# EAGLE design main 1.0 (EAGLE 7.2.0)
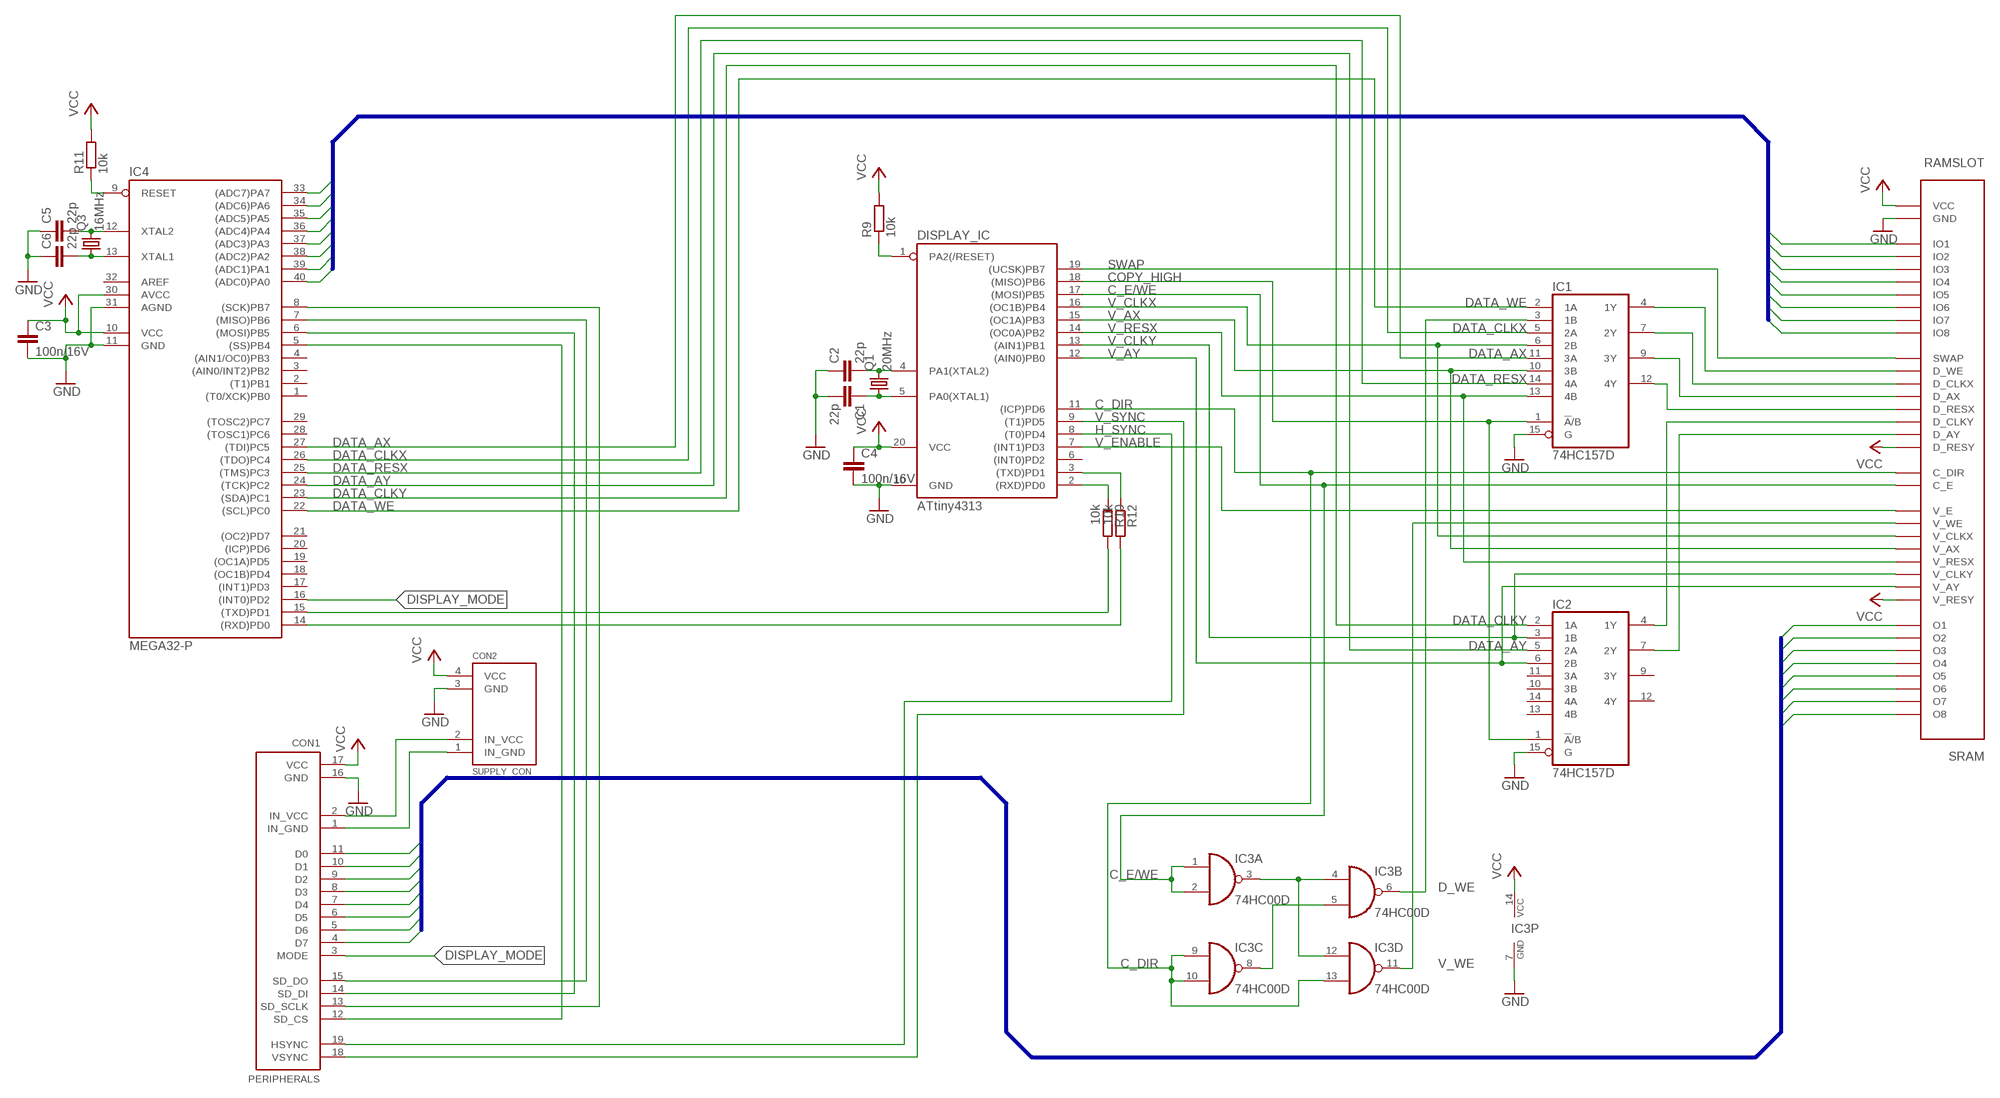
[diagram p0: schematic, sheet 1]

## Parts
C1  22p  C-EUC0603  [C0603]
C2  22p  C-EUC0603  [C0603]
C3  100n/16V  C-EUC0603  [C0603]
C4  100n/16V  C-EUC0603  [C0603]
C5  22p  C-EUC0603  [C0603]
C6  22p  C-EUC0603  [C0603]
CON1  PERIPHERALS  [PERIPHERALS_CON]
CON2  SUPPLY_CON  [SUPPLY_CON]
DISPLAY_IC  ATtiny4313  TINY2313-*P*  [DIL20]
IC1  74HC157D  [SO16]
IC2  74HC157D  [SO16]
IC3  74HC00D  [SO14]
IC4  MEGA32-P  [DIL40]
Q1  20MHz  CRYSTALS-NOGND-HC49  [HC49]
Q3  16MHz  CRYSTALS-NOGND-HC49  [HC49]
R9  10k  R-EU_R0603  [R0603]
R10  10k  R-EU_R0603  [R0603]
R11  10k  R-EU_R0603  [R0603]
R12  10k  R-EU_R0603  [R0603]
RAMSLOT  SRAM  SLOT  [SLOT]

## Nets
C_DIR: DISPLAY_IC.11((ICP)PD6) IC3.9(C:I0) IC3.10(C:I1) IC3.13(D:I1) RAMSLOT.C_DIR RAMSLOT.C_DIRB(C_DIR)
C_E/WE: DISPLAY_IC.17((MOSI)PB5) IC3.1(A:I0) IC3.2(A:I1) RAMSLOT.C_E RAMSLOT.C_EB(C_E)
COPY_HIGH: DISPLAY_IC.18((MISO)PB6) IC1.1(!A!/B) IC2.1(!A!/B)
D_WE: IC1.3(1B) IC3.6(B:O)
DATA0: IC4.40((ADC0)PA0) RAMSLOT.IO1 RAMSLOT.IO1B(IO1)
DATA1: IC4.39((ADC1)PA1) RAMSLOT.IO2 RAMSLOT.IO2B(IO2)
DATA2: IC4.38((ADC2)PA2) RAMSLOT.IO3 RAMSLOT.IO3B(IO3)
DATA3: IC4.37((ADC3)PA3) RAMSLOT.IO4 RAMSLOT.IO4B(IO4)
DATA4: IC4.36((ADC4)PA4) RAMSLOT.IO5 RAMSLOT.IO5B(IO5)
DATA5: IC4.35((ADC5)PA5) RAMSLOT.IO6 RAMSLOT.IO6B(IO6)
DATA6: IC4.34((ADC6)PA6) RAMSLOT.IO7 RAMSLOT.IO7B(IO7)
DATA7: IC4.33((ADC7)PA7) RAMSLOT.IO8 RAMSLOT.IO8B(IO8)
DATA_AX: IC1.11(3A) IC4.27((TDI)PC5)
DATA_AY: IC2.5(2A) IC4.24((TCK)PC2)
DATA_CLKX: IC1.5(2A) IC4.26((TDO)PC4)
DATA_CLKY: IC2.2(1A) IC4.23((SDA)PC1)
DATA_RESX: IC1.14(4A) IC4.25((TMS)PC3)
DATA_WE: IC1.2(1A) IC4.22((SCL)PC0)
DISPLAY_MODE: CON1.3(MODE) IC4.16((INT0)PD2)
GND: C1.2 C2.1 C3.2 C4.2 C5.1 C6.1 CON1.16(GND) CON2.3(GND) DISPLAY_IC.10(GND) IC1.15(G) IC2.15(G) IC3.7(P:GND) IC4.11(GND) IC4.31(AGND) RAMSLOT.GND RAMSLOT.GNDB(GND)
H_SYNC: CON1.19(HSYNC) DISPLAY_IC.8((T0)PD4)
IN_GND: CON1.1(IN_GND) CON2.1(IN_GND)
MAIN_RX: IC4.14((RXD)PD0) R12.2
MAIN_TX: IC4.15((TXD)PD1) R10.2
N$1: IC4.9(RESET) R11.1
N$3: IC3.3(A:O) IC3.4(B:I0) IC3.12(D:I0)
N$4: IC3.5(B:I1) IC3.8(C:O)
N$7: CON1.2(IN_VCC) CON2.2(IN_VCC)
N$12: DISPLAY_IC.1(PA2(/RESET)) R9.1
N$15: DISPLAY_IC.3((TXD)PD1) R12.1
N$16: C5.2 IC4.12(XTAL2) Q3.2
N$17: C6.2 IC4.13(XTAL1) Q3.1
N$24: DISPLAY_IC.2((RXD)PD0) R10.1
N$30: C1.1 DISPLAY_IC.5(PA0(XTAL1)) Q1.1
N$31: C2.2 DISPLAY_IC.4(PA1(XTAL2)) Q1.2
N$47: IC1.4(1Y) RAMSLOT.D_WE RAMSLOT.D_WEB(D_WE)
N$48: IC1.7(2Y) RAMSLOT.D_CLKX RAMSLOT.D_CLKXB(D_CLKX)
N$49: IC1.9(3Y) RAMSLOT.D_AX RAMSLOT.D_AXB(D_AX)
N$50: IC1.12(4Y) RAMSLOT.D_RESX RAMSLOT.D_RESXB(D_RESX)
N$51: IC2.4(1Y) RAMSLOT.D_CLKY RAMSLOT.D_CLKYB(D_CLKY)
N$52: IC2.7(2Y) RAMSLOT.D_AY RAMSLOT.D_AYB(D_AY)
O0: CON1.11(D0) RAMSLOT.O1 RAMSLOT.O1B(O1)
O1: CON1.10(D1) RAMSLOT.O2 RAMSLOT.O2B(O2)
O2: CON1.9(D2) RAMSLOT.O3 RAMSLOT.O3B(O3)
O3: CON1.8(D3) RAMSLOT.O4 RAMSLOT.O4B(O4)
O4: CON1.7(D4) RAMSLOT.O5 RAMSLOT.O5B(O5)
O5: CON1.6(D5) RAMSLOT.O6 RAMSLOT.O6B(O6)
O6: CON1.5(D6) RAMSLOT.O7 RAMSLOT.O7B(O7)
O7: CON1.4(D7) RAMSLOT.O8 RAMSLOT.O8B(O8)
SD_CS: CON1.12(SD_CS) IC4.5((SS)PB4)
SD_DI: CON1.14(SD_DI) IC4.6((MOSI)PB5)
SD_DO: CON1.15(SD_DO) IC4.7((MISO)PB6)
SD_SCLK: CON1.13(SD_SCLK) IC4.8((SCK)PB7)
SWAP: DISPLAY_IC.19((UCSK)PB7) RAMSLOT.SWAP RAMSLOT.SWAPB(SWAP)
V_AX: DISPLAY_IC.15((OC1A)PB3) IC1.10(3B) RAMSLOT.V_AX RAMSLOT.V_AXB(V_AX)
V_AY: DISPLAY_IC.12((AIN0)PB0) IC2.6(2B) RAMSLOT.V_AY RAMSLOT.V_AYB(V_AY)
V_CLKX: DISPLAY_IC.16((OC1B)PB4) IC1.6(2B) RAMSLOT.V_CLKX RAMSLOT.V_CLKXB(V_CLKX)
V_CLKY: DISPLAY_IC.13((AIN1)PB1) IC2.3(1B) RAMSLOT.V_CLKY RAMSLOT.V_CLKYB(V_CLKY)
V_ENABLE: DISPLAY_IC.7((INT1)PD3) RAMSLOT.V_E RAMSLOT.V_EB(V_E)
V_RESX: DISPLAY_IC.14((OC0A)PB2) IC1.13(4B) RAMSLOT.V_RESX RAMSLOT.V_RESXB(V_RESX)
V_SYNC: CON1.18(VSYNC) DISPLAY_IC.9((T1)PD5)
V_WE: IC3.11(D:O) RAMSLOT.V_WE RAMSLOT.V_WEB(V_WE)
VCC: C3.1 C4.1 CON1.17(VCC) CON2.4(VCC) DISPLAY_IC.20(VCC) IC3.14(P:VCC) IC4.10(VCC) IC4.30(AVCC) R9.2 R11.2 RAMSLOT.D_RESY RAMSLOT.D_RESYB(D_RESY) RAMSLOT.V_RESY RAMSLOT.V_RESYB(V_RESY) RAMSLOT.VCC RAMSLOT.VCCB(VCC)
Unconnected: DISPLAY_IC.6((INT0)PD2) IC2.9(3Y) IC2.10(3B) IC2.11(3A) IC2.12(4Y) IC2.13(4B) IC2.14(4A) IC4.1((T0/XCK)PB0) IC4.2((T1)PB1) IC4.3((AIN0/INT2)PB2) IC4.4((AIN1/OC0)PB3) IC4.17((INT1)PD3) IC4.18((OC1B)PD4) IC4.19((OC1A)PD5) IC4.20((ICP)PD6) IC4.21((OC2)PD7) IC4.28((TOSC1)PC6) IC4.29((TOSC2)PC7)

## Buses
DATA[0..7]
O[0..7]

## Power pins joined to a net without a drawn wire
AREF: IC4.32(AREF)
GND: IC1.8(GND) IC2.8(GND)
VCC: IC1.16(VCC) IC2.16(VCC)

## Library data of the parts
C1-C6 = rcl:C-EU: CAPACITOR, European symbol
CON1 = peripherals connector:PERIPHERALS
CON2 = supply connector:SUPPLY_CON
DISPLAY_IC = avr-7:TINY2313*: Atmel Tiny2313 2K Flash, 128 bytes EEPROM, 128 bytes RAM
IC1 IC2 = 74xx-eu:74*157: Quadruple 2-line to 1-line data SELECTOR/MULTIPLEXER
IC3 = 74xx-eu:74*00: Quad 2-input NAND gate
IC4 = avr-7:MEGA32-P: MICROCONTROLLER 32 Kbytes FLASH 2 Kbytes SRAM 1 Kbytes EEPROM USART 8-channel 10 bit ADC
Q1 Q3 = IQD-Frequency-Products:CRYSTALS-NOGND: CRYSTALS CAN NOT GROUNDED
R9-R12 = rcl:R-EU_: RESISTOR, European symbol
RAMSLOT = SRAM slot:SLOT

## Board
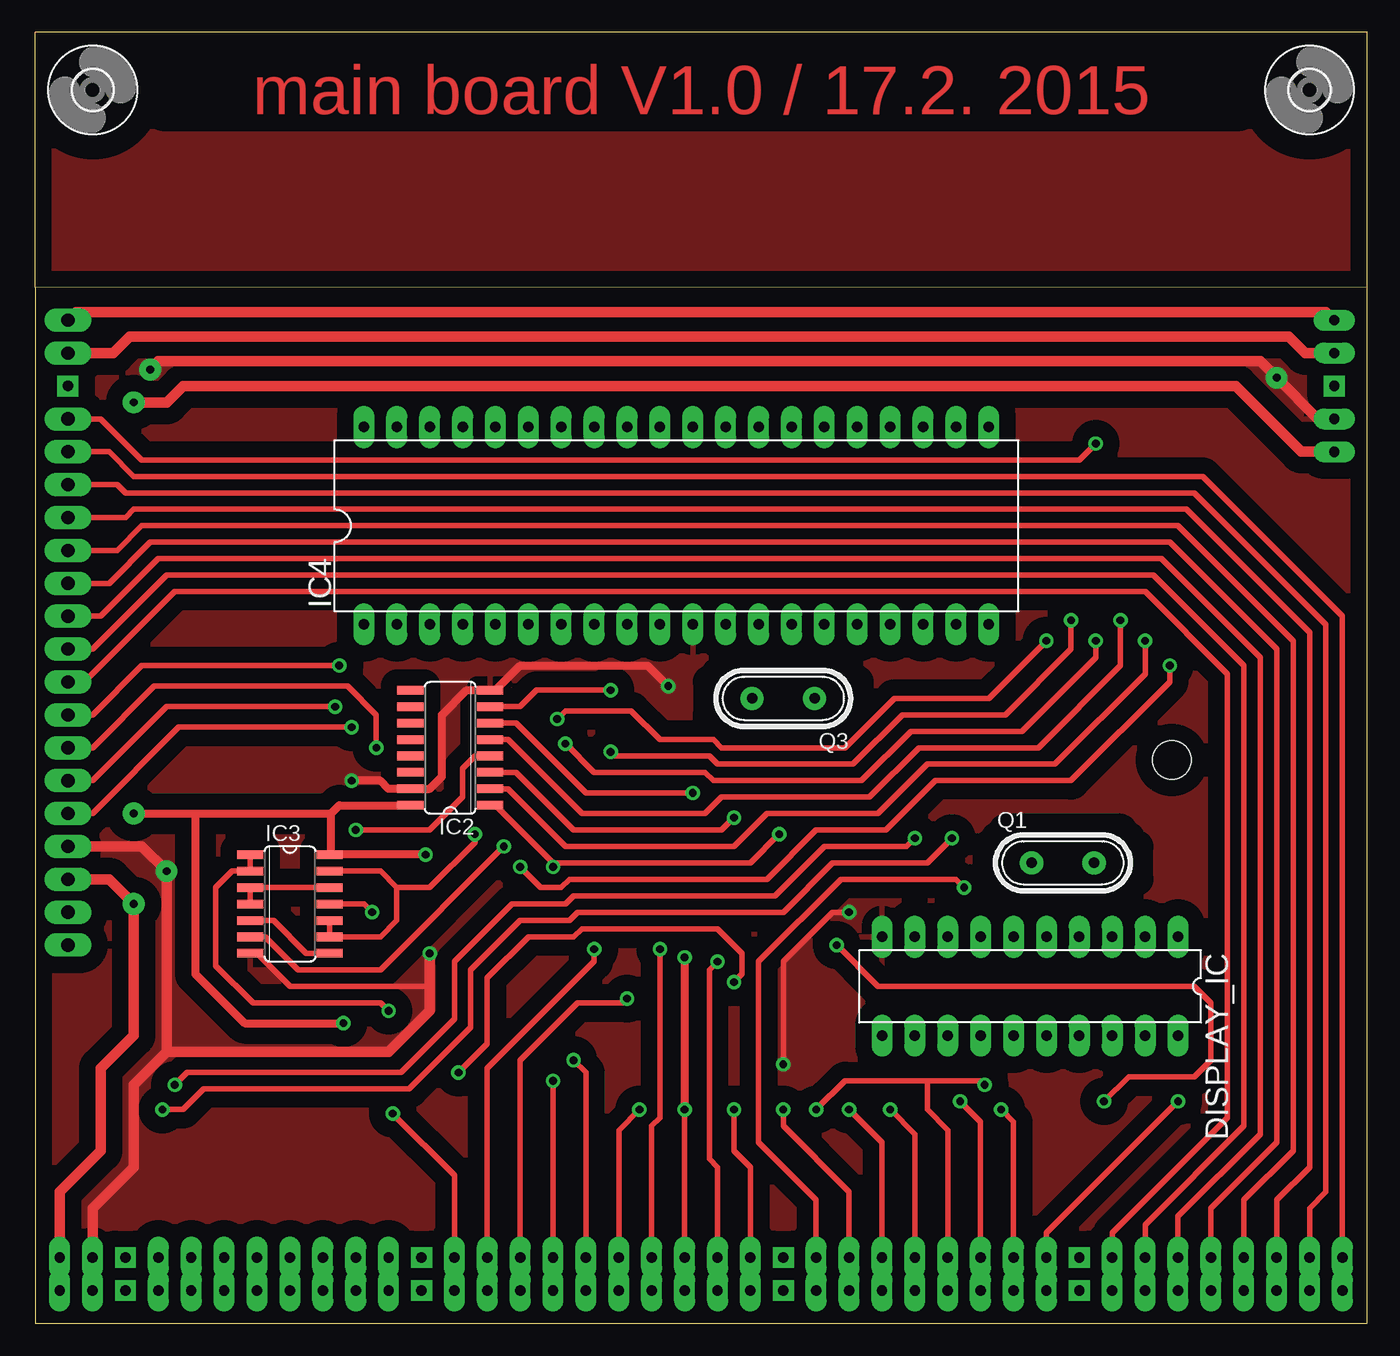
[diagram p1: board, top side]
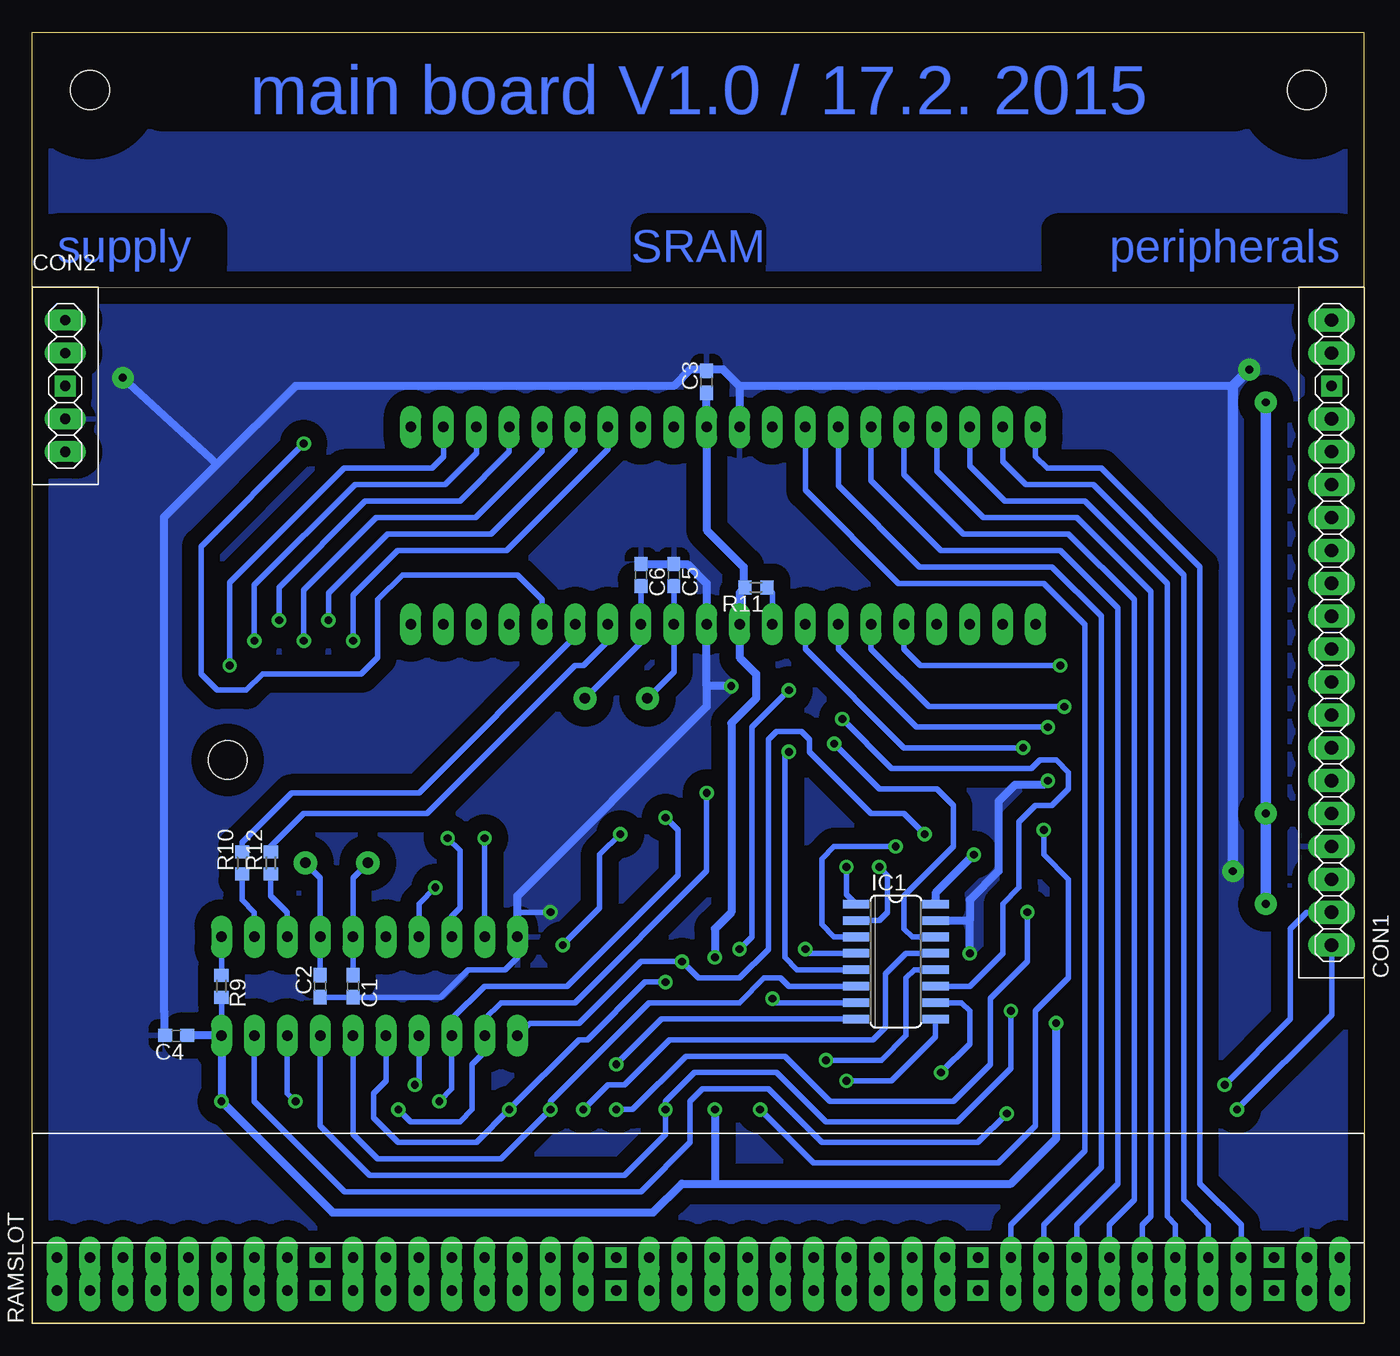
[diagram p2: board, bottom side, seen from below]

Size 102.87 x 99.69 mm. Coordinates in mm from the lower left corner, seen from the top.
Outline: 102.87,80.01 102.87,0 0,0 0,80
Outline: 102.87,80.01 0,80
Outline: 0,80 0,99.69 102.87,99.69 102.87,80.01
Copper layers (1*16): Top 0.035mm / dielectric 1.5mm / Bottom 0.035mm
Design rules "Aroidzap_DesignRules20mil": minimum track width 16mil, minimum drill 0.6mm, track to track 20mil, track to pad 20mil, pad to pad 20mil, via to via 20mil, smd to smd 16mil, copper to edge 20mil, drill to drill 40mil, minimum pad ring 16mil, minimum via ring 10mil, stop-mask expansion 4mil, vias tented up to drill 0mil, thermal gap 30mil
Holes 3 mm at 87.79,43.5
tRestrict: area 53.3,45.7 to 62.2,50.8; area 62.2,46.4 to 62.9,50.2; area 62.9,47 to 63.5,49.5; area 52.7,46.4 to 53.3,50.2; area 52.1,47 to 52.7,49.5; area 74.9,33 to 83.8,38.1; area 83.8,33.7 to 84.5,37.5; area 84.5,34.3 to 85.1,36.8; area 74.3,33.7 to 74.9,37.5; area 73.7,34.3 to 74.3,36.8

### Footprints (pad centres in the part's own frame; a part is rotated, then mirrored left to right if it is on the bottom)
C0603 = smd 1.1 x 1: 1 -0.85,0; 2 0.85,0
PERIPHERALS_CON = drill 1.016 long: 1 24.13,0; 2 21.59,0; 3 16.51,0; 4 13.97,0; 5 11.43,0; 6 8.89,0; 7 6.35,0; 8 3.81,0; 9 1.27,0; 10 -1.27,0; 11 -3.81,0; 12 -6.35,0; 13 -8.89,0; 14 -11.43,0; 15 -13.97,0; 16 -16.51,0; 17 -19.05,0; 18 -21.59,0; 19 -24.13,0 | drill 0.8 square: NC 19.05,0
SUPPLY_CON = drill 0.8 long: 1 0,5.08; 2 0,2.54; 3 0,-2.54; 4 0,-5.08 | drill 0.8 square: NC 0,0
DIL20 = drill 0.813 long: 1 -11.43,-3.81; 2 -8.89,-3.81; 3 -6.35,-3.81; 4 -3.81,-3.81; 5 -1.27,-3.81; 6 1.27,-3.81; 7 3.81,-3.81; 8 6.35,-3.81; 9 8.89,-3.81; 10 11.43,-3.81; 11 11.43,3.81; 12 8.89,3.81; 13 6.35,3.81; 14 3.81,3.81; 15 1.27,3.81; 16 -1.27,3.81; 17 -3.81,3.81; 18 -6.35,3.81; 19 -8.89,3.81; 20 -11.43,3.81
SO16 = smd 0.66 x 2.032: 1 -4.445,-3.073; 2 -3.175,-3.073; 3 -1.905,-3.073; 4 -0.635,-3.073; 5 0.635,-3.073; 6 1.905,-3.073; 7 3.175,-3.073; 8 4.445,-3.073; 9 4.445,3.073; 10 3.175,3.073; 11 1.905,3.073; 12 0.635,3.073; 13 -0.635,3.073; 14 -1.905,3.073; 15 -3.175,3.073; 16 -4.445,3.073
SO14 = smd 0.66 x 2.032: 1 -3.81,-3.073; 2 -2.54,-3.073; 3 -1.27,-3.073; 4 0,-3.073; 5 1.27,-3.073; 6 2.54,-3.073; 7 3.81,-3.073; 8 3.81,3.073; 9 2.54,3.073; 10 1.27,3.073; 11 0,3.073; 12 -1.27,3.073; 13 -2.54,3.073; 14 -3.81,3.073
DIL40 = drill 0.813 long: 1 -24.13,-7.62; 2 -21.59,-7.62; 3 -19.05,-7.62; 4 -16.51,-7.62; 5 -13.97,-7.62; 6 -11.43,-7.62; 7 -8.89,-7.62; 8 -6.35,-7.62; 9 -3.81,-7.62; 10 -1.27,-7.62; 11 1.27,-7.62; 12 3.81,-7.62; 13 6.35,-7.62; 14 8.89,-7.62; 15 11.43,-7.62; 16 13.97,-7.62; 17 16.51,-7.62; 18 19.05,-7.62; 19 21.59,-7.62; 20 24.13,-7.62; 21 24.13,7.62; 22 21.59,7.62; 23 19.05,7.62; 24 16.51,7.62; 25 13.97,7.62; 26 11.43,7.62; 27 8.89,7.62; 28 6.35,7.62; 29 3.81,7.62; 30 1.27,7.62; 31 -1.27,7.62; 32 -3.81,7.62; 33 -6.35,7.62; 34 -8.89,7.62; 35 -11.43,7.62; 36 -13.97,7.62; 37 -16.51,7.62; 38 -19.05,7.62; 39 -21.59,7.62; 40 -24.13,7.62
HC49 = drill 0.813 pad 1.8: 1 -2.413,0; 2 2.413,0
R0603 = smd 1 x 1.1: 1 -0.85,0; 2 0.85,0
SLOT = drill 0.8 long: C_DIR -5.08,1.27; C_DIRB -2.54,1.27; C_E -5.08,3.81; C_EB -2.54,3.81; D_AX -5.08,-11.43; D_AXB -2.54,-11.43; D_AY -5.08,-3.81; D_AYB -2.54,-3.81; D_CLKX -5.08,-13.97; D_CLKXB -2.54,-13.97; D_CLKY -5.08,-6.35; D_CLKYB -2.54,-6.35; D_RESX -5.08,-8.89; D_RESXB -2.54,-8.89; D_RESY -5.08,-1.27; D_RESYB -2.54,-1.27; D_WE -5.08,-16.51; D_WEB -2.54,-16.51; GND -5.08,-46.99; GNDB -2.54,-46.99; IO1 -5.08,-41.91; IO1B -2.54,-41.91; IO2 -5.08,-39.37; IO2B -2.54,-39.37; IO3 -5.08,-36.83; IO3B -2.54,-36.83; IO4 -5.08,-34.29; IO4B -2.54,-34.29; IO5 -5.08,-31.75; IO5B -2.54,-31.75; IO6 -5.08,-29.21; IO6B -2.54,-29.21; IO7 -5.08,-26.67; IO7B -2.54,-26.67; IO8 -5.08,-24.13; IO8B -2.54,-24.13; O1 -5.08,31.75; O1B -2.54,31.75; O2 -5.08,34.29; O2B -2.54,34.29; O3 -5.08,36.83; O3B -2.54,36.83; O4 -5.08,39.37; O4B -2.54,39.37; O5 -5.08,41.91; O5B -2.54,41.91; O6 -5.08,44.45; O6B -2.54,44.45; O7 -5.08,46.99; O7B -2.54,46.99; O8 -5.08,49.53; O8B -2.54,49.53; SWAP -5.08,-19.05; SWAPB -2.54,-19.05; V_AX -5.08,16.51; V_AXB -2.54,16.51; V_AY -5.08,24.13; V_AYB -2.54,24.13; V_CLKX -5.08,13.97; V_CLKXB -2.54,13.97; V_CLKY -5.08,21.59; V_CLKYB -2.54,21.59; V_E -5.08,8.89; V_EB -2.54,8.89; V_RESX -5.08,19.05; V_RESXB -2.54,19.05; V_RESY -5.08,26.67; V_RESYB -2.54,26.67; V_WE -5.08,11.43; V_WEB -2.54,11.43; VCC -5.08,-49.53; VCCB -2.54,-49.53 | drill 0.8 square: NC1 -5.08,-44.45; NC2 -2.54,-44.45; NC3 -5.08,-21.59; NC4 -2.54,-21.59; NC5 -5.08,6.35; NC6 -2.54,6.35; NC7 -5.08,29.21; NC8 -2.54,29.21
3,0 = hole 3: 0,0

### Placement (x,y rotation side)
C1  78.1,26.04 270 bottom
C2  80.64,26.04 90 bottom
C3  50.8,72.71 90 bottom
C4  91.76,22.23 180 bottom
C5  53.34,57.78 270 bottom
C6  55.88,57.78 270 bottom
CON1  2.54,53.34 90 bottom
CON2  100.33,72.39 0 bottom
DISPLAY_IC  76.83,26.04 180 top
IC1  36.2,27.94 270 bottom
IC2  32.07,44.45 90 top
IC3  19.68,32.38 270 top
IC4  49.53,61.59 0 top
Q1  79.38,35.56 0 top
Q3  57.79,48.26 180 top
R9  88.27,26.04 270 bottom
R10  86.68,35.56 90 bottom
R11  46.99,56.83 180 bottom
R12  84.45,35.56 90 bottom
RAMSLOT  51.44,7.62 90 bottom
U$1  [3,0]  98.42,95.25 0 top
U$2  [3,0]  4.45,95.25 0 top

### Tracks (layer width: path | path; a pad name or v marks a point on that pad's centre or on a via)
C_DIR  (via drill 0.6)
  Top 0.406: RAMSLOT.C_DIR RAMSLOT.C_DIRB 52.71,12.06 52.07,12.7 52.07,27.3 v52.71,27.94 | IC3.10 IC3.9 26.67,29.84 27.94,31.11 27.94,33.66 | IC3.13 26.67,34.92 27.94,33.66 | 27.94,33.66 30.48,33.66 33.97,37.15 v33.97,37.78
  Bottom 0.406: DISPLAY_IC.11 64.45,23.18 60.64,23.18 55.88,27.94 v52.71,27.94 51.44,26.67 48.26,26.67 46.04,28.89 46.04,45.09 45.4,45.72 43.5,45.72 42.86,45.09 42.86,44.13 38.1,39.37 35.56,39.37 v33.97,37.78
C_E/WE  (via drill 0.6)
  Top 0.406: RAMSLOT.C_E RAMSLOT.C_EB 55.25,12.06 53.98,13.34 v53.98,16.51 | IC3.1 IC3.2 15.24,34.92 13.97,33.66 13.97,27.62 16.83,24.77 26.67,24.77 v27.3,24.13
  Bottom 0.406: DISPLAY_IC.17 80.64,15.24 76.83,11.43 57.15,11.43 53.98,14.61 v53.98,16.51 53.98,17.14 51.75,19.37 45.4,19.37 41.59,15.56 31.43,15.56 27.3,19.68 v27.3,24.13
COPY_HIGH  (via drill 0.6)
  Top 0.406: v82.55,17.14 84.45,19.05 89.53,19.05 90.8,20.32 90.8,24.77 89.53,26.04 65.09,26.04 v61.91,29.21 | IC2.1 35.56,40.01 40.01,35.56 | v40.01,35.24 40.01,35.56 | 40.01,35.56 55.25,35.56 v57.47,37.78
  Bottom 0.406: DISPLAY_IC.18 83.19,17.78 v82.55,17.14 | IC1.1 40.01,33.12 v40.01,35.24 | v57.47,37.78 59.05,36.2 59.05,32.07 v61.91,29.21
D_WE  (via drill 0.6)
  Top 0.406: IC3.6 17.78,29.84 20.32,27.3 26.67,27.3 v36.2,36.83
  Bottom 0.406: IC1.3 40.96,29.84 41.91,30.8 41.91,35.88 40.96,36.83 v36.2,36.83
DATA0
  Bottom 0.406: RAMSLOT.IO1 RAMSLOT.IO1B 9.53,7.62 12.7,10.79 12.7,58.42 20.32,66.04 24.5,66.04 25.4,66.94 IC4.40
DATA1
  Bottom 0.406: RAMSLOT.IO2 RAMSLOT.IO2B 12.06,7.62 13.97,9.53 13.97,57.78 20.95,64.77 26.14,64.77 27.94,66.57 IC4.39
DATA2
  Bottom 0.406: RAMSLOT.IO3 RAMSLOT.IO3B 14.61,7.62 15.24,8.26 15.24,57.15 21.59,63.5 27.79,63.5 30.48,66.19 IC4.38
DATA3
  Bottom 0.406: RAMSLOT.IO4 RAMSLOT.IO4B 17.14,7.62 16.51,8.26 16.51,56.52 22.22,62.23 29.43,62.23 33.02,65.82 IC4.37
DATA4
  Bottom 0.406: RAMSLOT.IO5 RAMSLOT.IO5B 19.68,7.62 17.78,9.53 17.78,55.88 22.86,60.96 30.98,60.96 35.56,65.54 IC4.36
DATA5
  Bottom 0.406: RAMSLOT.IO6 RAMSLOT.IO6B 22.22,7.62 19.05,10.79 19.05,55.24 23.5,59.69 32.71,59.69 38.1,65.08 IC4.35
DATA6
  Bottom 0.406: RAMSLOT.IO7 RAMSLOT.IO7B 24.77,7.62 20.32,12.06 20.32,54.61 24.13,58.42 34.35,58.42 40.64,64.71 IC4.34
DATA7
  Bottom 0.406: RAMSLOT.IO8 RAMSLOT.IO8B 27.3,7.62 21.59,13.34 21.59,53.98 24.77,57.15 36,57.15 43.18,64.33 IC4.33
DATA_AX  (via drill 0.6)
  Top 0.406: v78.1,52.7 73.66,48.26 66.36,48.26 62.55,44.45 53.02,44.45 52.39,45.09 48.26,45.09 46.04,47.31 40.96,47.31 v40.32,46.67
  Bottom 0.406: IC4.27 58.42,67.51 66.24,59.69 74.67,59.69 78.1,56.26 v78.1,52.7 | IC1.11 30.48,26.04 27.94,28.57 27.94,32.38 26.67,33.66 26.67,38.73 25.4,40.01 24.13,40.01 22.86,41.27 22.86,42.55 23.81,43.5 25.08,43.5 25.72,42.86 36.51,42.86 v40.32,46.67
DATA_AY  (via drill 0.6)
  Top 0.406: v83.82,54.29 83.82,50.8 77.47,44.45 68.26,44.45 64.45,40.64 53.02,40.64 51.75,39.37 42.23,39.37 36.51,45.09 IC2.5
  Bottom 0.406: IC4.24 66.04,67.31 69.85,63.5 77.16,63.5 83.82,56.84 v83.82,54.29
DATA_CLKX  (via drill 0.6)
  Top 0.406: v80.01,54.29 80.01,52.07 74.93,46.99 66.99,46.99 63.18,43.18 52.71,43.18 52.07,43.81 44.77,43.81 v44.45,44.13
  Bottom 0.406: IC4.26 60.96,67.45 67.45,60.96 75.43,60.96 80.01,56.38 v80.01,54.29 | IC1.5 43.82,27.3 44.77,28.26 44.77,43.81 v44.45,44.13
DATA_CLKY  (via drill 0.6)
  Top 0.406: v85.72,52.7 85.72,50.16 78.74,43.18 68.9,43.18 65.09,39.37 56.52,39.37 53.98,36.83 40.96,36.83 36.51,41.27 IC2.2
  Bottom 0.406: IC4.23 68.58,67.2 71.01,64.77 77.97,64.77 85.72,57.01 v85.72,52.7
DATA_RESX  (via drill 0.6)
  Top 0.406: v81.91,52.7 81.91,51.44 76.2,45.72 67.63,45.72 63.82,41.91 52.39,41.91 51.75,42.55 43.18,42.55 v40.96,44.77
  Bottom 0.406: IC4.25 63.5,67.36 68.62,62.23 76.32,62.23 81.91,56.63 v81.91,52.7 | IC1.14 34.93,29.84 35.56,30.48 35.56,33.02 31.75,36.83 31.75,40.01 33.02,41.27 37.47,41.27 v40.96,44.77
DATA_WE  (via drill 0.6)
  Top 0.406: v37.47,35.24 39.05,33.66 40.64,33.66 41.28,34.29 56.52,34.29 60.33,38.1 65.72,38.1 69.53,41.91 80.01,41.91 87.63,49.53 v87.63,50.8
  Bottom 0.406: IC4.22 71.12,66.94 72.02,66.04 78.8,66.04 87.63,57.21 v87.63,50.8 | v37.47,35.24 36.83,34.61 36.83,31.75 37.47,31.11 IC1.2
DISPLAY_MODE  (via drill 0.6)
  Top 0.406: CON1.3 5.08,69.85 8.26,66.67 80.64,66.67 v81.91,67.94
  Bottom 0.406: v81.91,67.94 89.85,60.01 89.85,50.16 88.58,48.9 86.36,48.9 85.09,50.16 77.47,50.16 76.2,51.44 76.2,55.88 74.3,57.78 65.41,57.78 63.5,55.88 IC4.16
GND  (via drill 0.6, 0.6 pad 1.68)
  Top 0.406: IC3.7 17.14,28.57 19.68,26.04 30.48,26.04 | v57.79,20 57.79,27.94 61.6,31.75 v62.87,31.75
  Top 0.61: v48.9,49.21 47.31,50.8 37.47,50.8 35.56,48.9 IC2.8 33.34,48.9 31.43,46.99 31.43,42.23 30.48,41.27 IC2.15 27.3,41.27 26.67,41.91 v24.45,41.91
  Top 0.813: RAMSLOT.GND RAMSLOT.GNDB 4.45,8.89 7.62,12.06 7.62,18.41 10.16,20.95 | v8.89,73.66 9.53,74.3 94.61,74.3 v95.88,73.03 99.06,69.85 CON2.3 | 10.16,20.95 v10.16,34.92 8.26,36.83 CON1.16 | 10.16,20.95 27.3,20.95 30.48,24.13 30.48,26.04 v30.48,28.57
  Bottom 0.406: DISPLAY_IC.10 65.41,28.26 66.36,27.3 69.21,27.3 71.33,25.18 C1.2 C2.1 | IC1.8 54.29,23.5 v57.79,20 | v62.87,31.75 65.41,31.75
  Bottom 0.61: v30.48,28.57 30.48,31.11 | v48.9,49.21 50.8,49.21 | 50.8,49.21 IC4.11 50.8,57.15 52.29,58.63 C5.1 C6.1 | 50.8,49.21 50.8,47.62 65.41,33.02 65.41,31.75 DISPLAY_IC.10 | IC1.15 30.48,31.11 | v24.45,41.91 24.77,41.59 26.99,41.59 28.26,40.32 28.26,34.92 30.48,32.7 30.48,31.11 | C4.2 92.71,22.23 92.71,24.13 92.71,62.23 88.58,66.36 | 10.16,72.39 48.26,72.39 | 48.26,72.39 49.53,73.66 50.8,73.66 | 50.8,73.66 52.07,73.66 53.34,72.39 82.55,72.39 88.58,66.36 | 48.26,72.39 IC4.31 | C3.2 50.8,73.66 | v95.88,73.03 88.58,66.36
  Bottom 0.813: v10.16,34.92 10.16,72.39 v8.89,73.66
  pour Bottom (isolate 1.27): 0,99.69 102.87,99.69 102.87,0 0,0
  pour Top (isolate 1.27): 0,99.69 102.87,99.69 102.87,0 0,0
H_SYNC  (via drill 0.6)
  Top 0.406: v9.84,16.51 11.43,16.51 13.02,18.1 28.89,18.1 33.66,22.86 33.66,27.3 37.47,31.11 41.28,31.11 41.91,31.75 57.79,31.75 61.6,35.56 68.9,35.56 v70.8,37.47
  Bottom 0.406: v9.84,16.51 2.54,23.81 CON1.19 | v70.8,37.47 69.85,36.51 69.85,32.07 70.48,31.43 DISPLAY_IC.8
IN_GND
  Top 0.813: CON1.1 3.17,78.11 99.69,78.11 CON2.1
MAIN_RX
  Bottom 0.406: R12.2 84.45,36.83 81.91,39.37 72.39,39.37 60.96,50.8 60.33,50.8 58.42,52.7 IC4.14
MAIN_TX
  Bottom 0.406: R10.2 86.68,37.15 82.87,40.96 73.02,40.96 60.96,53.02 IC4.15
N$1
  Bottom 0.406: R11.1 45.72,56.41 IC4.9
N$2  (via drill 0.6)
  other vias: 98.42,95.25
N$3
  Top 0.406: IC3.4 IC3.3 IC3.12
N$4
  Top 0.406: IC3.8 20.95,28.57 18.41,31.11 IC3.5
N$5  (via drill 0.6)
  other vias: 4.45,95.25
N$6  (via drill 0.6)
  other vias: 87.79,43.5
N$7
  Top 0.813: CON1.2 6.03,74.93 7.3,76.2 96.84,76.2 98.11,74.93 CON2.2
N$12
  Bottom 0.406: DISPLAY_IC.1 R9.1
N$15
  Bottom 0.406: R12.1 84.45,33.02 83.19,31.75 DISPLAY_IC.3
N$16
  Bottom 0.406: Q3.2 53.34,50.29 IC4.12 C5.2
N$17
  Bottom 0.406: Q3.1 55.88,52.58 IC4.13 C6.2
N$24
  Bottom 0.406: DISPLAY_IC.2 85.72,31.75 86.68,32.7 R10.1
N$30
  Bottom 0.406: Q1.1 78.1,34.42 DISPLAY_IC.5 C1.1
N$31
  Bottom 0.406: Q1.2 80.64,34.42 DISPLAY_IC.4 C2.2
N$47  (via drill 0.6)
  Top 0.406: RAMSLOT.D_WE RAMSLOT.D_WEB 34.93,19.68 43.18,27.94 v43.18,28.89
  Bottom 0.406: IC1.4 42.86,28.57 v43.18,28.89
N$48  (via drill 0.6)
  Top 0.406: RAMSLOT.D_CLKX RAMSLOT.D_CLKXB 37.47,20.32 41.91,24.77 45.4,24.77 v45.72,25.08
  Bottom 0.406: IC1.7 45.4,24.77 v45.72,25.08
N$49  (via drill 0.6)
  Top 0.406: RAMSLOT.D_AX RAMSLOT.D_AXB v40.01,18.73
  Bottom 0.406: IC1.9 33.12,22.12 36.51,18.73 v40.01,18.73
N$50  (via drill 0.6)
  Top 0.406: RAMSLOT.D_RESX RAMSLOT.D_RESXB 42.55,19.37 v41.59,20.32
  Bottom 0.406: IC1.12 34.77,27.3 35.4,26.67 35.4,22.23 37.31,20.32 v41.59,20.32
N$51  (via drill 0.6)
  Top 0.406: RAMSLOT.D_CLKY RAMSLOT.D_CLKYB 45.09,14.92 v46.67,16.51 | IC2.4 33.97,43.81 33.02,42.86 33.02,40.64 30.48,38.1 v24.77,38.1
  Bottom 0.406: v24.77,38.1 24.77,36.2 22.86,34.29 22.86,26.67 25.4,24.13 25.4,15.24 28.26,12.38 42.55,12.38 v46.67,16.51
N$52  (via drill 0.6)
  Top 0.406: RAMSLOT.D_AY RAMSLOT.D_AYB 47.62,15.24 48.26,15.88 v48.26,28.89 | IC2.7 37.47,47.62 38.74,48.9 v44.45,48.9
  Bottom 0.406: v44.45,48.9 47.31,46.04 47.31,29.84 v48.26,28.89
O0
  Top 0.406: RAMSLOT.O1 RAMSLOT.O1B 83.19,6.99 92.08,15.88 92.08,50.16 85.72,56.52 10.79,56.52 3.81,49.53 CON1.11
O1
  Top 0.406: RAMSLOT.O2 RAMSLOT.O2B 85.72,7.62 93.34,15.24 93.34,50.8 86.36,57.78 10.16,57.78 4.45,52.07 CON1.10
O2
  Top 0.406: RAMSLOT.O3 RAMSLOT.O3B 88.27,8.26 94.61,14.61 94.61,51.44 86.99,59.05 9.53,59.05 5.08,54.61 CON1.9
O3
  Top 0.406: RAMSLOT.O4 RAMSLOT.O4B 90.8,8.89 95.88,13.97 95.88,52.07 87.63,60.33 8.89,60.33 5.71,57.15 CON1.8
O4
  Top 0.406: RAMSLOT.O5 RAMSLOT.O5B 93.34,9.53 97.16,13.34 97.16,52.7 88.27,61.59 8.26,61.59 6.35,59.69 CON1.7
O5
  Top 0.406: RAMSLOT.O6 RAMSLOT.O6B 95.88,9.53 98.42,12.06 98.42,53.34 88.9,62.87 7.62,62.87 6.98,62.23 CON1.6
O6
  Top 0.406: RAMSLOT.O7 RAMSLOT.O7B 98.42,8.89 99.69,10.16 99.69,53.98 89.53,64.14 6.98,64.14 6.35,64.77 CON1.5
O7
  Top 0.406: RAMSLOT.O8 RAMSLOT.O8B 100.96,54.61 90.17,65.41 7.62,65.41 5.71,67.31 CON1.4
SD_CS  (via drill 0.6)
  Top 0.406: v23.5,50.8 8.26,50.8 4.45,46.99 CON1.12
  Bottom 0.406: IC4.5 35.56,52.07 34.29,50.8 v23.5,50.8
SD_DI  (via drill 0.6)
  Top 0.406: CON1.14 4.45,41.91 10.16,47.62 v23.18,47.62
  Bottom 0.406: IC4.6 38.1,52.07 33.66,47.62 v23.18,47.62
SD_DO  (via drill 0.6)
  Top 0.406: CON1.15 4.45,39.37 11.11,46.04 v24.45,46.04
  Bottom 0.406: v24.45,46.04 34.61,46.04 40.64,52.07 IC4.7
SD_SCLK  (via drill 0.6)
  Top 0.406: v26.35,44.45 26.35,46.99 24.13,49.21 9.21,49.21 4.45,44.45 CON1.13
  Bottom 0.406: IC4.8 43.18,52.07 35.56,44.45 v26.35,44.45
SWAP  (via drill 0.6)
  Top 0.406: RAMSLOT.SWAP RAMSLOT.SWAPB 32.38,11.43 v27.62,16.19
  Bottom 0.406: DISPLAY_IC.19 85.72,17.14 78.74,10.16 55.88,10.16 52.07,13.97 52.07,17.14 51.12,18.1 46.04,18.1 41.91,13.97 29.84,13.97 v27.62,16.19
V_AX  (via drill 0.6)
  Top 0.406: RAMSLOT.V_AX RAMSLOT.V_AXB 67.94,14.61 v66.04,16.51 | v32.7,19.37 34.93,21.59 34.93,26.67 38.1,29.84 41.59,29.84 42.23,30.48 52.71,30.48 54.61,28.57 54.61,26.99 v53.98,26.35
  Bottom 0.406: DISPLAY_IC.15 75.56,18.73 76.52,17.78 76.52,15.88 74.61,13.97 68.58,13.97 v66.04,16.51 60.64,21.91 60.01,21.91 55.56,26.35 v53.98,26.35 | IC1.10 31.11,24.77 30.48,24.13 30.48,21.59 v32.7,19.37
V_AY  (via drill 0.6)
  Top 0.406: RAMSLOT.V_AY RAMSLOT.V_AYB 75.56,15.56 v74.61,16.51 | v50.8,40.96 42.55,40.96 37.15,46.35 IC2.6
  Bottom 0.406: v50.8,40.96 50.8,34.92 60.96,24.77 66.67,24.77 67.94,23.5 DISPLAY_IC.12 67.94,20.95 68.9,20 68.9,16.51 69.85,15.56 73.66,15.56 v74.61,16.51
V_CLKX  (via drill 0.6)
  Top 0.406: RAMSLOT.V_CLKX RAMSLOT.V_CLKXB 65.41,13.97 v62.87,16.51
  Bottom 0.406: DISPLAY_IC.16 78.1,14.61 76.2,12.7 66.67,12.7 v62.87,16.51 62.87,17.14 55.25,24.77 48.26,24.77 46.36,26.67 45.09,26.67 44.45,26.04 IC1.6
V_CLKY  (via drill 0.6)
  Top 0.406: RAMSLOT.V_CLKY RAMSLOT.V_CLKYB 73.02,15.56 v71.44,17.14 | IC2.3 37.15,42.55 41.59,38.1 53.02,38.1 v53.98,39.05
  Bottom 0.406: v71.44,17.14 70.48,18.1 DISPLAY_IC.13 70.48,23.5 67.94,26.04 61.6,26.04 53.02,34.61 53.02,38.1 v53.98,39.05
V_ENABLE  (via drill 0.6)
  Top 0.406: RAMSLOT.V_E RAMSLOT.V_EB 60.33,9.53 55.88,13.97 55.88,27.94 62.23,34.29 71.12,34.29 v71.75,33.66
  Bottom 0.406: DISPLAY_IC.7 73.02,32.38 v71.75,33.66
V_RESX  (via drill 0.6)
  Top 0.406: RAMSLOT.V_RESX RAMSLOT.V_RESXB 70.48,14.92 68.9,16.51 68.9,18.73 | v73.34,18.41 73.02,18.73 68.9,18.73 | v60.33,16.51 62.55,18.73 68.9,18.73
  Bottom 0.406: DISPLAY_IC.14 73.02,18.73 v73.34,18.41 | IC1.13 35.4,28.57 36.99,26.99 36.99,22.86 37.94,21.91 53.66,21.91 57.15,18.41 58.42,18.41 v60.33,16.51
V_SYNC  (via drill 0.6)
  Top 0.406: v10.79,18.41 11.75,19.37 28.26,19.37 32.38,23.5 32.38,27.94 36.83,32.38 40.96,32.38 41.59,33.02 57.15,33.02 60.96,36.83 67.31,36.83 v67.94,37.47
  Bottom 0.406: v10.79,18.41 5.71,23.5 5.71,30.48 4.45,31.75 CON1.18 | v67.94,37.47 DISPLAY_IC.9
V_WE  (via drill 0.6)
  Top 0.406: RAMSLOT.V_WE RAMSLOT.V_WEB 62.87,10.16 57.79,15.24 v57.79,16.51 | IC3.11 25.4,32.38 v26.04,31.75
  Bottom 0.406: v26.04,31.75 26.04,27.94 28.89,25.08 28.89,20 31.75,17.14 41.28,17.14 44.77,20.64 52.39,20.64 56.52,16.51 v57.79,16.51
VCC  (via drill 0.6, 0.6 pad 1.68)
  Top 0.406: RAMSLOT.D_RESY RAMSLOT.D_RESYB v50.17,16.51 | RAMSLOT.V_RESY RAMSLOT.V_RESYB 78.1,6.99 v88.27,17.14
  Top 0.61: v50.17,28.26 v50.17,16.51 | 12.38,39.37 12.38,26.99 16.19,23.18 v23.81,23.18 | v30.16,36.2 IC3.14 22.86,36.3 22.86,39.37 | v7.62,39.37 12.38,39.37 | 12.38,39.37 22.86,39.37 | 22.86,39.37 23.5,40.01 IC2.16
  Top 0.813: RAMSLOT.VCC RAMSLOT.VCCB 1.91,10.16 5.08,13.34 5.08,19.68 7.62,22.23 v7.62,32.38 5.71,34.29 CON1.17 | v7.62,71.12 10.16,71.12 11.43,72.39 92.71,72.39 97.79,67.31 CON2.4
  Bottom 0.406: R9.2 DISPLAY_IC.20 | 47.94,56.94 R11.2
  Bottom 0.61: 47.94,56.94 47.94,58.42 50.8,61.28 IC4.30 C3.1 | 50.17,10.79 52.71,10.79 54.93,8.57 79.69,8.57 v88.27,17.14 DISPLAY_IC.20 C4.1 | 50.17,10.79 27.3,10.79 23.81,14.29 v23.81,23.18 | v50.17,16.51 50.17,10.79 | R11.2 48.26,56.41 IC4.10 48.26,51.44 46.99,50.16 46.99,48.26 48.9,46.35 48.9,31.75 50.17,30.48 v50.17,28.26 | v30.16,36.2 33.12,33.24 IC1.16
  Bottom 0.813: v7.62,32.38 v7.62,39.37 v7.62,71.12

### Text on the board
Top: main board V1.0 / 17.2. 2015
Bottom: main board V1.0 / 17.2. 2015 | peripherals | SRAM | supply